# Altium schematic sheet Pilot.SchDoc
size A4
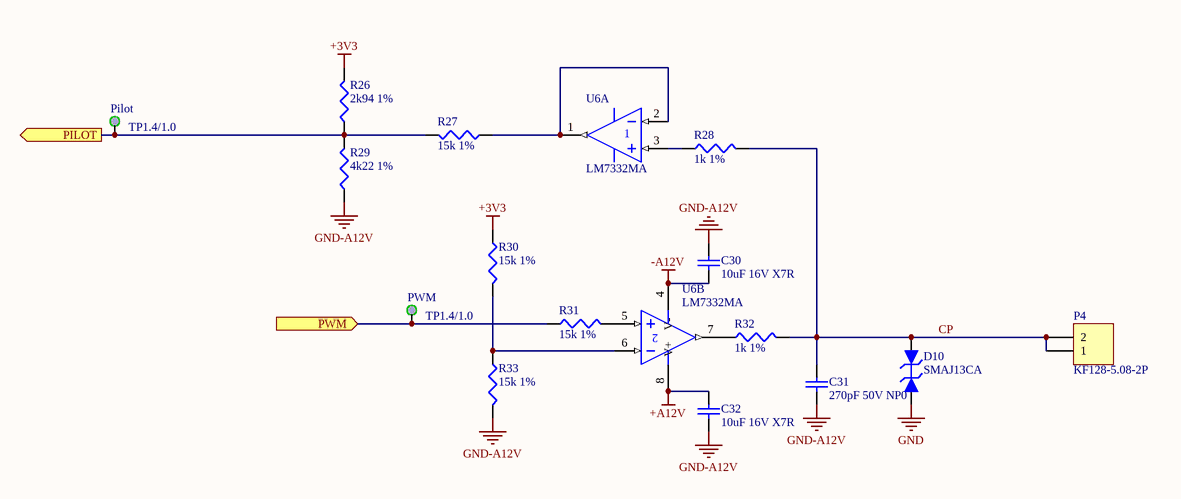
[diagram p0: Pilot.SchDoc]

## Parts
C30  10uF 16V X7R  [CAPC3216N]
C31  270pF 50V NP0  [CAPC2012N]
C32  10uF 16V X7R  [CAPC3216N]
D10  SMAJ13CA  [DSO-C2/G1.6]
P4  KF128-5.08-2P  [KF128-5.08-2P]
Pilot  TP1.4/1.0  [TP1.4/1.0]  (no BOM)
PWM  TP1.4/1.0  [TP1.4/1.0]  (no BOM)
R26  2k94 1%  [RESC2012N]
R27  15k 1%  [RESC2012N]
R28  1k 1%  [RESC2012N]
R29  4k22 1%  [RESC2012N]
R30  15k 1%  [RESC2012N]
R31  15k 1%  [RESC2012N]
R32  1k 1%  [RESC2012N]
R33  15k 1%  [RESC2012N]
U6  LM7332MA  [D008_M]  (parts A,B of 2)

## Ports
PILOT (out), PWM (in)

## Nets
+3V3: R26.2 R30.1
+A12V: C32.2 U6.8(V+)
-A12V: C30.1 U6.4(V-)
GND: D10.1
GND-A12V: C30.2 C31.1 C32.1 R29.1 R33.2
CP: C31.2 D10.2 P4.1 P4.2 R28.2 R32.2
PILOT: Pilot.1 R26.1 R27.2 R29.2 ; port PILOT
PWM: PWM.1 R31.1 ; port PWM
NetR27_1: R27.1 U6.1(OUT) U6.2(IN-)
NetR28_1: R28.1 U6.3(IN+)
NetR30_2: R30.2 R33.1 U6.6(IN-)
NetR31_2: R31.2 U6.5(IN+)
NetR32_1: R32.1 U6.7(OUT)

## Library data of the parts
C30 C32 = Cap Semi: Ceramic Capactor; Value: 100pF; Published: 8-Jun-2000; LatestRevisionDate: 29-May-2009; LatestRevisionNote: IPC-7351 Footprint Added.; PackageReference: C1206; Publisher: Altium Limited; PackageDescription: Chip Capacitor
C31 = Cap Semi: Capactor; Value: 100pF; Published: 8-Jun-2000; LatestRevisionDate: 29-May-2009; LatestRevisionNote: IPC-7351 Footprint Added.; PackageReference: C1206; Publisher: Altium Limited; PackageDescription: Chip Capacitor
D10 = Zener bidirectional: Bidirectional zener diode; Manufacturer: ON
P4 = Header 2: Connector 2-Pin; LatestRevisionDate: 17-Jul-2002; LatestRevisionNote: Re-released for DXP Platform.; Publisher: Altium Limited
R26-R33 = Res3: Resistor
U6 = LM258D: Dual Operational Amplifier; Manufacturer: TI; Published: 15-Apr-2002; LatestRevisionDate: 13-Apr-2006; LatestRevisionNote: IPC-7351 Footprint Added.; DatasheetVersion: Aug-1988; PackageVersion: Jan-1998; PackageReference: D008; Publisher: Altium Limited; PackageDescription: 8-Pin Small Outline Integrated Circuit 1.27 mm Pitch; Code_IPC: SOIC127P600-8; ComponentLink1Description: Manufacturer Link; ComponentLink1URL: http://www.ti.com/; ComponentLink2Description: Datasheet; ComponentLink2URL: http://www-s.ti.com/sc/ds/lm258.pdf; Price: *